# EAGLE design c264-magic-cart-rev1 (EAGLE 9.6.2)
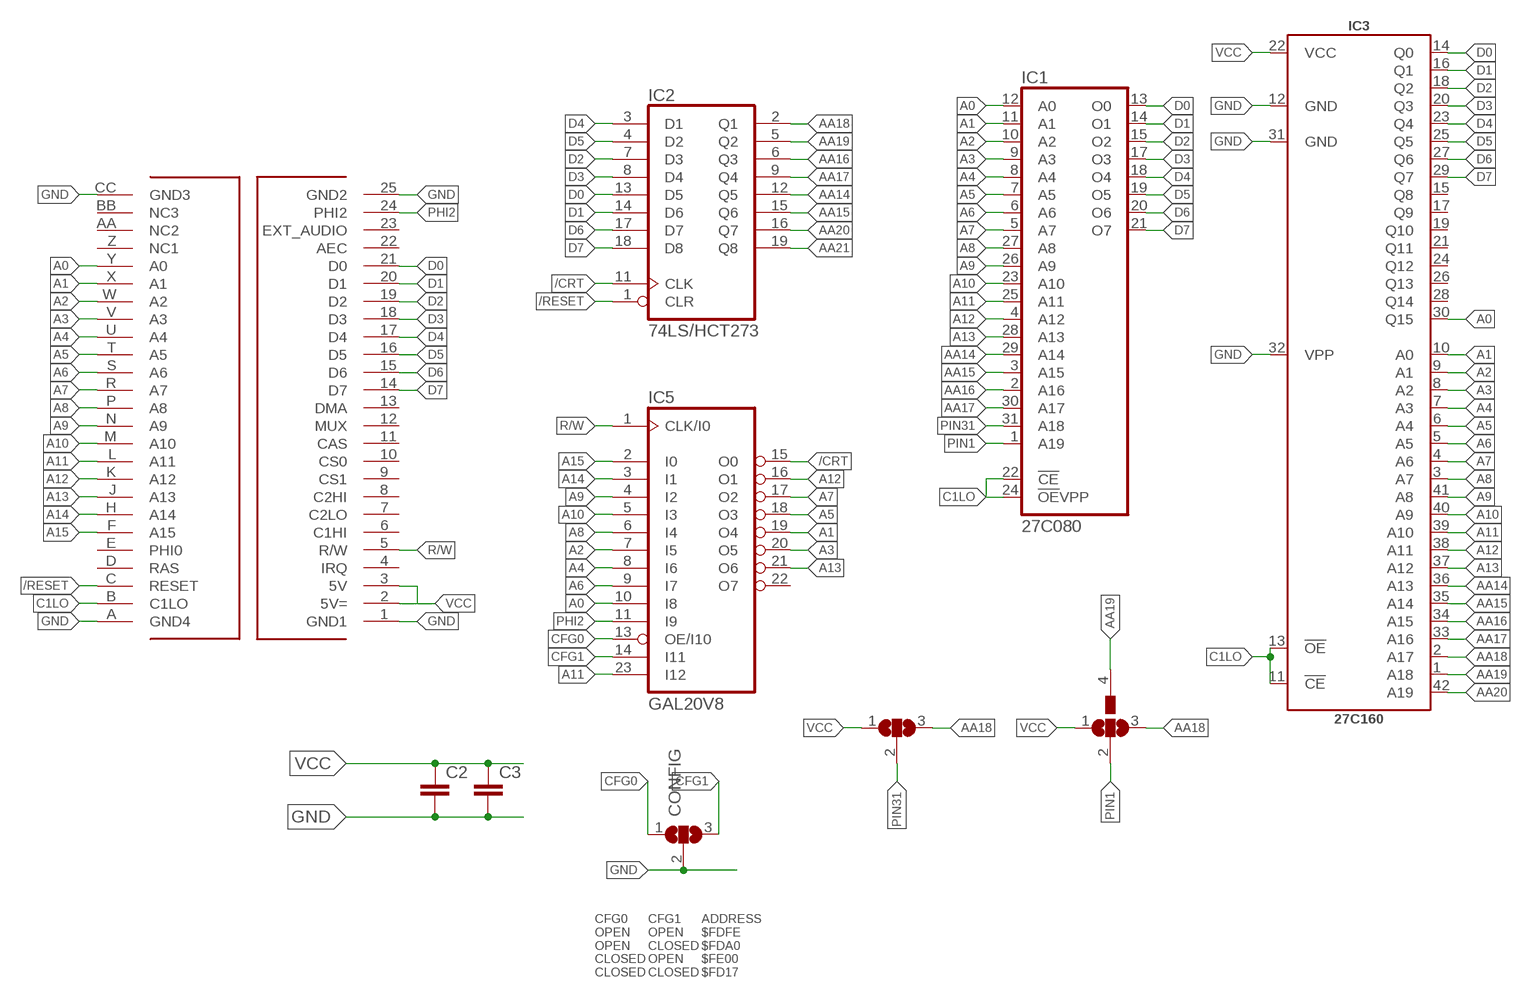
[diagram p0: schematic, sheet 1]

## Parts
C2  C-EU025-024X044  [C025-024X044]
C3  C-EU025-024X044  [C025-024X044]
CONFIG  SJ2W  [SJ_2]
IC1  27C080  27C08032P6  [DIL32]
IC2  74LS/HCT273  74HCT273N  [DIL20]
IC3  27C160  27C160_DIP42  [DIP42]
IC5  GAL20V8  20V8  [DIL24-3]
SJ1  SJ2W  [SJ_2]
U$1  C16_CARTRIDGE  [C16_CART]
U$2  SJ3  [SJ_3]

## Nets
/CRT: IC2.11(CLK) IC5.15(O0)
/RESET: IC2.1(CLR) U$1.C(RESET)
A0: IC1.12(A0) IC3.30(Q15) IC5.10(I8) U$1.Y(A0)
A1: IC1.11(A1) IC3.10(A0) IC5.19(O4) U$1.X(A1)
A2: IC1.10(A2) IC3.9(A1) IC5.7(I5) U$1.W(A2)
A3: IC1.9(A3) IC3.8(A2) IC5.20(O5) U$1.V(A3)
A4: IC1.8(A4) IC3.7(A3) IC5.8(I6) U$1.U(A4)
A5: IC1.7(A5) IC3.6(A4) IC5.18(O3) U$1.T(A5)
A6: IC1.6(A6) IC3.5(A5) IC5.9(I7) U$1.S(A6)
A7: IC1.5(A7) IC3.4(A6) IC5.17(O2) U$1.R(A7)
A8: IC1.27(A8) IC3.3(A7) IC5.6(I4) U$1.P(A8)
A9: IC1.26(A9) IC3.41(A8) IC5.4(I2) U$1.N(A9)
A10: IC1.23(A10) IC3.40(A9) IC5.5(I3) U$1.M(A10)
A11: IC1.25(A11) IC3.39(A10) IC5.23(I12) U$1.L(A11)
A12: IC1.4(A12) IC3.38(A11) IC5.16(O1) U$1.K(A12)
A13: IC1.28(A13) IC3.37(A12) IC5.21(O6) U$1.J(A13)
A14: IC5.3(I1) U$1.H(A14)
A15: IC5.2(I0) U$1.F(A15)
AA14: IC1.29(A14) IC2.12(Q5) IC3.36(A13)
AA15: IC1.3(A15) IC2.15(Q6) IC3.35(A14)
AA16: IC1.2(A16) IC2.6(Q3) IC3.34(A15)
AA17: IC1.30(A17) IC2.9(Q4) IC3.33(A16)
AA18: IC2.2(Q1) IC3.2(A17) SJ1.3 U$2.3
AA19: IC2.5(Q2) IC3.1(A18) U$2.4
AA20: IC2.16(Q7) IC3.42(A19)
AA21: IC2.19(Q8)
C1LO: IC1.22(!CE) IC1.24(!OE!VPP) IC3.11(!CE) IC3.13(!OE) U$1.B(C1LO)
CFG0: CONFIG.1 IC5.13(OE/I10)
CFG1: CONFIG.3 IC5.14(I11)
D0: IC1.13(O0) IC2.13(D5) IC3.14(Q0) U$1.21(D0)
D1: IC1.14(O1) IC2.14(D6) IC3.16(Q1) U$1.20(D1)
D2: IC1.15(O2) IC2.7(D3) IC3.18(Q2) U$1.19(D2)
D3: IC1.17(O3) IC2.8(D4) IC3.20(Q3) U$1.18(D3)
D4: IC1.18(O4) IC2.3(D1) IC3.23(Q4) U$1.17(D4)
D5: IC1.19(O5) IC2.4(D2) IC3.25(Q5) U$1.16(D5)
D6: IC1.20(O6) IC2.17(D7) IC3.27(Q6) U$1.15(D6)
D7: IC1.21(O7) IC2.18(D8) IC3.29(Q7) U$1.14(D7)
GND: C2.2 C3.2 CONFIG.2 IC3.12(GND) IC3.31(GND) IC3.32(VPP) U$1.1(GND1) U$1.25(GND2) U$1.A(GND4) U$1.CC(GND3)
PHI2: IC5.11(I9) U$1.24(PHI2)
PIN1: IC1.1(A19) U$2.2
PIN31: IC1.31(A18) SJ1.2
R/W: IC5.1(CLK/I0) U$1.5(R/W)
VCC: C2.1 C3.1 IC3.22(VCC) SJ1.1 U$1.2(5V=) U$1.3(5V) U$2.1
Unconnected: IC3.15(Q8) IC3.17(Q9) IC3.19(Q10) IC3.21(Q11) IC3.24(Q12) IC3.26(Q13) IC3.28(Q14) IC5.22(O7) U$1.4(IRQ) U$1.6(C1HI) U$1.7(C2LO) U$1.8(C2HI) U$1.9(CS1) U$1.10(CS0) U$1.11(CAS) U$1.12(MUX) U$1.13(DMA) U$1.22(AEC) U$1.23(EXT_AUDIO) U$1.AA(NC2) U$1.BB(NC3) U$1.D(RAS) U$1.E(PHI0) U$1.Z(NC1)

## Notes on the sheet
- CFG0
  OPEN
  OPEN
  CLOSED
  CLOSED
- CFG1
  OPEN
  CLOSED
  OPEN
  CLOSED
- ADDRESS
  $FDFE
  $FDA0
  $FE00
  $FD17

## Power pins joined to a net without a drawn wire
GND: IC1.16(GND) IC2.10(GND) IC5.12(GND)
VCC: IC1.32(VCC) IC2.20(VCC) IC5.24(VCC)

## Library data of the parts
C2 C3 = rcl:C-EU: CAPACITOR, European symbol; SPICEPREFIX: C
CONFIG = jumper:SJ2W: SMD solder JUMPER
IC1 = atmel_mod:27C080: 8-Megabit (1Mx8) OTP EPROM; MPN: AT27C080-90PU; OC_FARNELL: 1455026; OC_NEWARK: 58M3824
IC2 = 74xx-eu:74*273: Octal D type FLIP FLOP, clear
IC3 = sj_ic:27C160: 27C160 16 Mbit (2048 Kbit x 8 or 1024 Kbit x 16) EPROM
IC5 = pal:20V8: PAL; MF: FARNELL; MPN: GAL20V8B-25QP; OC_FARNELL: 3327462; OC_NEWARK: 70C8546
SJ1 = jumper-edit:SJ2W: SMD solder JUMPER
U$1 = 64kb_cart-twoboxes-short:C16_CARTRIDGE
U$2 = jumper-edit:SJ3

## Board
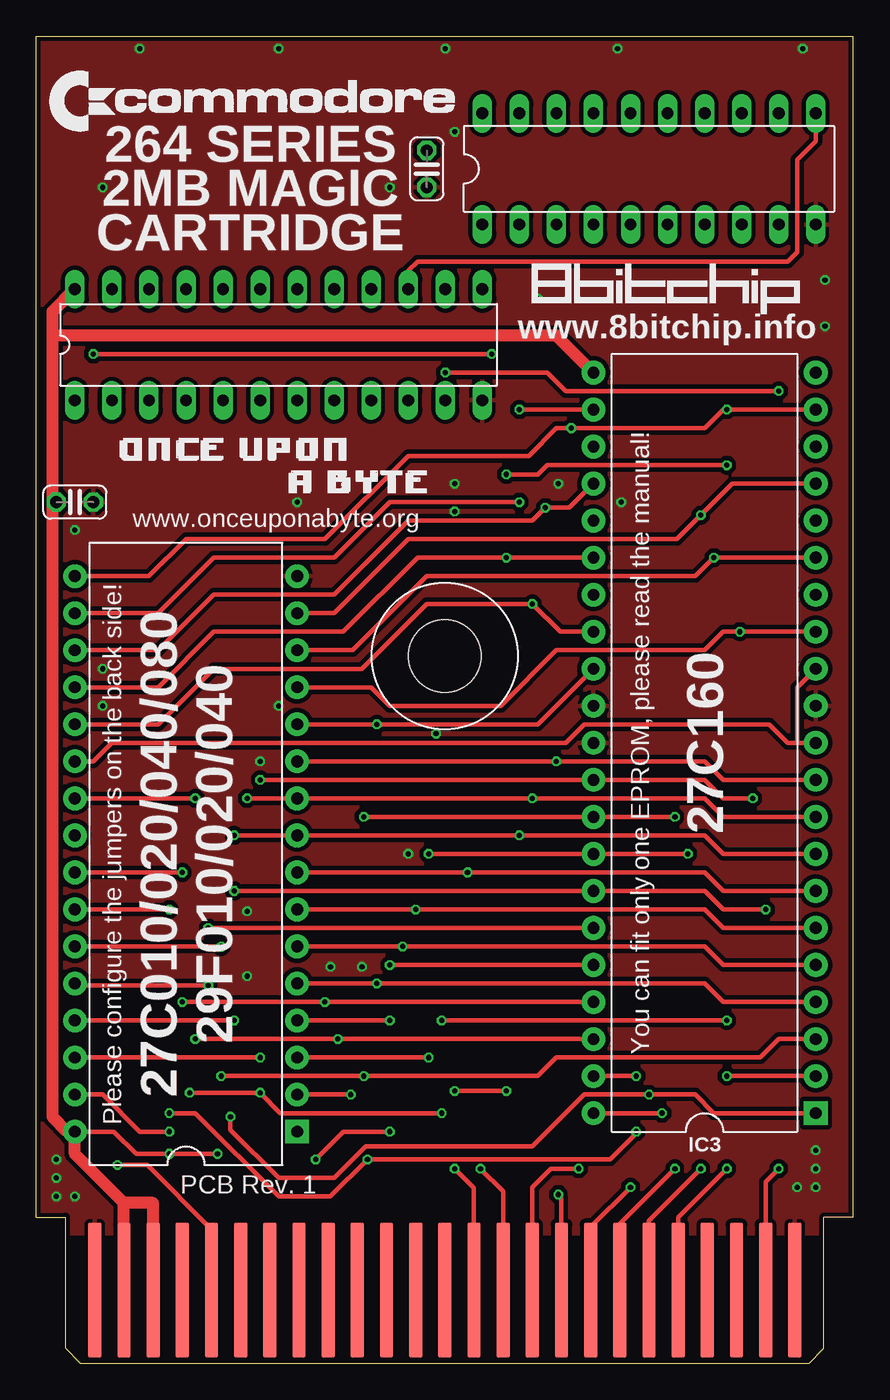
[diagram p1: board, top side]
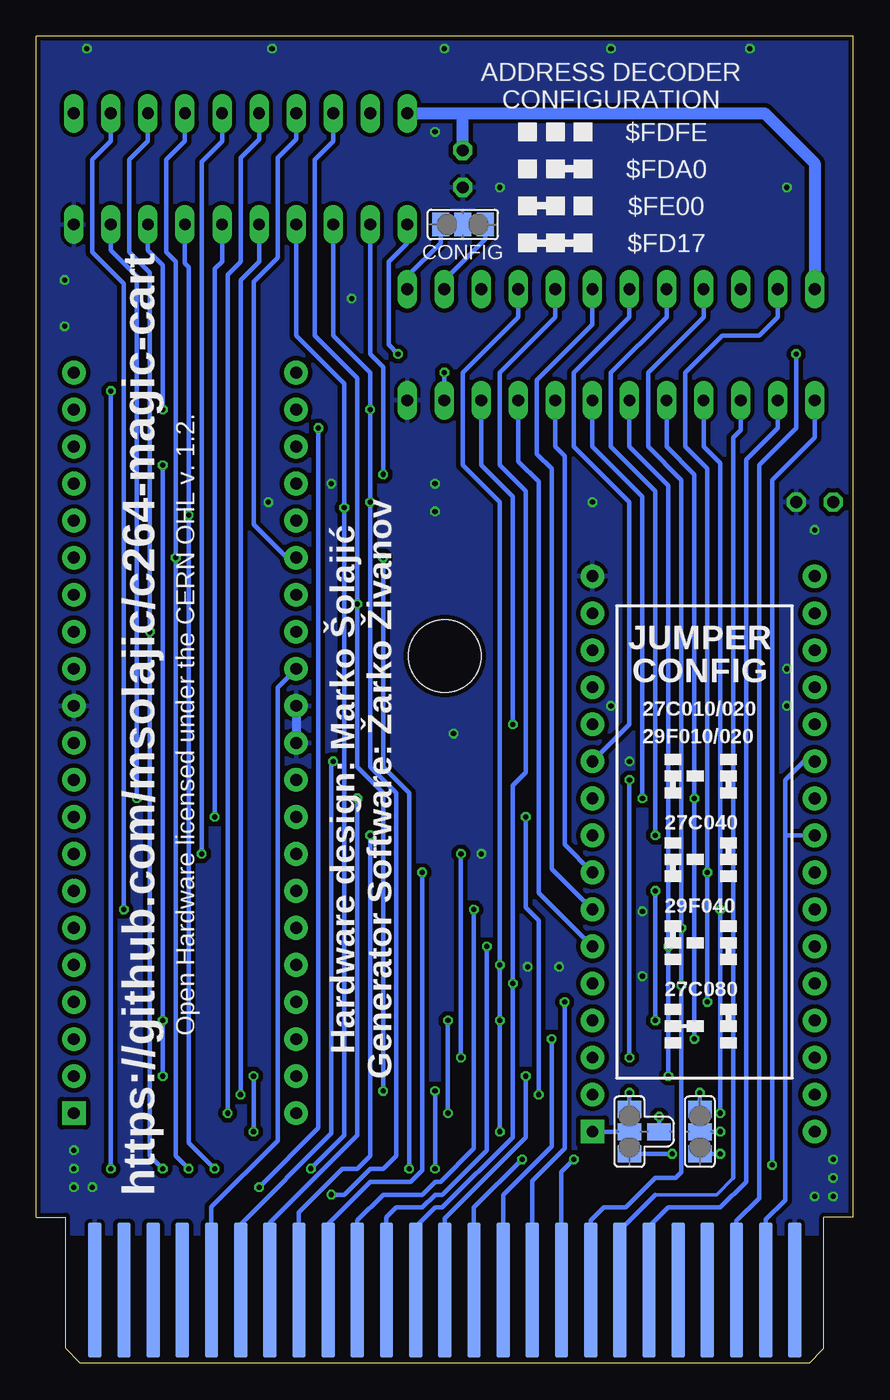
[diagram p2: board, bottom side, seen from below]

Size 56 x 91 mm. Coordinates in mm from the lower left corner, seen from the top.
Copper layers (1*16): Top 0.035mm / dielectric 1.5mm / Bottom 0.035mm
Design rules "SeeedStudio_2layer_DRU_no_angle_20140221": minimum track width 6mil, minimum drill 12mil, track to track 6mil, track to pad 6mil, pad to pad 6mil, via to via 6mil, smd to smd 0mil, copper to edge 10mil, drill to drill 10mil, minimum pad ring 10mil, minimum via ring 6mil, stop-mask expansion 2mil, vias tented up to drill 100mil, thermal gap 10mil

### Footprints (pad centres in the part's own frame; a part is rotated, then mirrored left to right if it is on the bottom)
C025-024X044 = drill 0.813 octagon: 1 -1.27,0; 2 1.27,0
SJ_2 = smd 1.168 x 1.6: 1 -1.524,0; 2 0,0; 3 1.524,0
DIL32 = drill 0.813 pad 1.626 square: 1 -19.05,-7.62 | drill 0.813 pad 1.626: 2 -16.51,-7.62; 3 -13.97,-7.62; 4 -11.43,-7.62; 5 -8.89,-7.62; 6 -6.35,-7.62; 7 -3.81,-7.62; 8 -1.27,-7.62; 9 1.27,-7.62; 10 3.81,-7.62; 11 6.35,-7.62; 12 8.89,-7.62; 13 11.43,-7.62; 14 13.97,-7.62; 15 16.51,-7.62; 16 19.05,-7.62; 17 19.05,7.62; 18 16.51,7.62; 19 13.97,7.62; 20 11.43,7.62; 21 8.89,7.62; 22 6.35,7.62; 23 3.81,7.62; 24 1.27,7.62; 25 -1.27,7.62; 26 -3.81,7.62; 27 -6.35,7.62; 28 -8.89,7.62; 29 -11.43,7.62; 30 -13.97,7.62; 31 -16.51,7.62; 32 -19.05,7.62
DIL20 = drill 0.813 long: 1 -11.43,-3.81; 2 -8.89,-3.81; 3 -6.35,-3.81; 4 -3.81,-3.81; 5 -1.27,-3.81; 6 1.27,-3.81; 7 3.81,-3.81; 8 6.35,-3.81; 9 8.89,-3.81; 10 11.43,-3.81; 11 11.43,3.81; 12 8.89,3.81; 13 6.35,3.81; 14 3.81,3.81; 15 1.27,3.81; 16 -1.27,3.81; 17 -3.81,3.81; 18 -6.35,3.81; 19 -8.89,3.81; 20 -11.43,3.81
DIP42 = drill 0.813 pad 1.626 square: 1 -25.4,-7.62 | drill 0.813 pad 1.626: 2 -22.86,-7.62; 3 -20.32,-7.62; 4 -17.78,-7.62; 5 -15.24,-7.62; 6 -12.7,-7.62; 7 -10.16,-7.62; 8 -7.62,-7.62; 9 -5.08,-7.62; 10 -2.54,-7.62; 11 0,-7.62; 12 2.54,-7.62; 13 5.08,-7.62; 14 7.62,-7.62; 15 10.16,-7.62; 16 12.7,-7.62; 17 15.24,-7.62; 18 17.78,-7.62; 19 20.32,-7.62; 20 22.86,-7.62; 21 25.4,-7.62; 22 25.4,7.62; 23 22.86,7.62; 24 20.32,7.62; 25 17.78,7.62; 26 15.24,7.62; 27 12.7,7.62; 28 10.16,7.62; 29 7.62,7.62; 30 5.08,7.62; 31 2.54,7.62; 32 0,7.62; 33 -2.54,7.62; 34 -5.08,7.62; 35 -7.62,7.62; 36 -10.16,7.62; 37 -12.7,7.62; 38 -15.24,7.62; 39 -17.78,7.62; 40 -20.32,7.62; 41 -22.86,7.62; 42 -25.4,7.62
DIL24-3 = drill 0.813 long: 1 -13.97,-3.81; 2 -11.43,-3.81; 3 -8.89,-3.81; 4 -6.35,-3.81; 5 -3.81,-3.81; 6 -1.27,-3.81; 7 1.27,-3.81; 8 3.81,-3.81; 9 6.35,-3.81; 10 8.89,-3.81; 11 11.43,-3.81; 12 13.97,-3.81; 13 13.97,3.81; 14 11.43,3.81; 15 8.89,3.81; 16 6.35,3.81; 17 3.81,3.81; 18 1.27,3.81; 19 -1.27,3.81; 20 -3.81,3.81; 21 -6.35,3.81; 22 -8.89,3.81; 23 -11.43,3.81; 24 -13.97,3.81
C16_CART = smd 0.9 x 9.25: 1 2,5; 2 4,5; 3 6,5; 4 8,5; 5 10,5; 6 12,5; 7 14,5; 8 16,5; 9 18,5; 10 20,5; 11 22,5; 12 24,5; 13 26,5; 14 28,5; 15 30,5; 16 32,5; 17 34,5; 18 36,5; 19 38,5; 20 40,5; 21 42,5; 22 44,5; 23 46,5; 24 48,5; 25 50,5 | smd 0.9 x 9.25 bottom: A 2,5; AA 46,5; B 4,5; BB 48,5; C 6,5; CC 50,5; D 8,5; E 10,5; F 12,5; H 14,5; J 16,5; K 18,5; L 20,5; M 22,5; N 24,5; P 26,5; R 28,5; S 30,5; T 32,5; U 34,5; V 36,5; W 38,5; X 40,5; Y 42,5; Z 44,5 | hole 5: 26,48.5
SJ_3 = smd 1.168 x 1.6: 1 -1.524,0; 2 0,0; 3 1.524,0; 4 0,-2.032

### Placement (x,y rotation side)
C2  26.77,81.92 270 top
C3  2.63,59.05 0 top
CONFIG  26.77,78.11 0 bottom
IC1  10.26,34.92 90 top
IC2  42.01,81.92 0 top
IC3  45.81,42.55 90 top
IC5  16.61,69.85 0 top
SJ1  10.51,15.88 90 bottom
U$1  2,0 0 top
U$2  15.34,15.88 90 bottom

### Tracks (layer width: path | path; a pad name or v marks a point on that pad's centre or on a via)
/CRT
  Top 0.305: IC5.15 25.5,74.93 26.13,75.56 51.53,75.56 52.16,76.2 52.16,82.55 53.44,83.82 IC2.11
/RESET  (via drill 0.35)
  Top 0.305: v31.21,69.22 v3.91,69.22
  Bottom 0.305: U$1.C 8,9.75 6.45,11.3 6.45,61.59 3.91,64.14 v3.91,69.22 | IC2.1 30.57,76.83 31.84,75.56 31.84,69.85 v31.21,69.22
A0  (via drill 0.35)
  Top 0.305: IC1.12 v23.34,43.81 34.38,43.81 IC3.30
  Bottom 0.305: U$1.Y 44,10.71 39.47,15.24 39.47,46.35 IC3.30 | IC5.10 25.5,61.59 23.34,59.44 v23.34,43.81
A1  (via drill 0.35)
  Top 0.305: IC3.10 47.09,40.01 45.81,41.27 v35.66,41.27 IC1.11
  Bottom 0.305: U$1.X 42,9.53 35.78,15.75 35.78,41.15 v35.66,41.27 | IC1.11 15.34,43.81 15.34,59.05 19.14,62.87 19.14,67.94 15.34,71.75 IC5.19
A2  (via drill 0.35)
  Top 0.305: IC3.9 47.09,37.47 45.81,38.73 v34,38.73 IC1.10 v14.45,38.73
  Bottom 0.305: U$1.W 40,9.62 34,15.62 v34,38.73 | v14.45,38.73 14.45,59.44 17.88,62.87 IC5.7
A3  (via drill 0.35)
  Top 0.305: IC3.8 47.09,34.92 45.81,36.2 v33.11,36.2 IC1.9 v13.56,36.2
  Bottom 0.305: v13.56,36.2 13.56,59.82 16.61,62.87 16.61,67.94 12.79,71.75 IC5.20 | U$1.V 38,10.36 35.02,13.34 34,13.34 33.11,14.22 v33.11,36.2
A4  (via drill 0.35)
  Top 0.305: IC1.8 v29.56,33.66 45.81,33.66 47.09,32.38 IC3.7
  Bottom 0.305: IC5.8 20.41,62.87 19.78,62.23 19.78,35.56 IC1.8 | U$1.U 36,9.56 33.11,12.45 30.32,12.45 29.56,13.21 v29.56,33.66
A5  (via drill 0.35)
  Top 0.305: IC1.7 v26,31.11 45.81,31.11 47.09,29.84 IC3.6
  Bottom 0.305: IC5.18 17.88,71.25 21.68,67.44 21.68,62.36 20.67,61.34 20.67,33.91 IC1.7 | U$1.T 34,9.78 32.23,11.56 29.56,11.56 28.67,12.45 28.29,12.45 26,14.73 v26,31.11
A6  (via drill 0.35)
  Top 0.305: IC1.6 v25.11,28.57 45.81,28.57 47.09,27.3 IC3.5
  Bottom 0.305: IC5.9 22.95,61.85 21.56,60.45 21.56,32.26 IC1.6 | v25.11,28.57 25.11,14.61 28.16,11.56 28.67,11.56 29.56,10.67 31.34,10.67 32,10.01 U$1.S
A7  (via drill 0.35)
  Top 0.305: IC1.5 v23.34,26.04 45.81,26.04 47.09,24.77 IC3.4
  Bottom 0.305: IC5.17 20.41,71.75 24.23,67.94 24.23,61.59 22.45,59.82 22.45,40.51 23.34,39.62 v23.34,26.04 23.34,15.49 28.16,10.67 28.67,10.67 30,9.34 U$1.R
A8  (via drill 0.35)
  Top 0.305: IC1.27 v12.67,28.57 | IC3.3 50.9,22.23 49.62,20.95 35.66,20.95 34.38,19.68 v22.45,19.68 v12.67,19.68
  Bottom 0.305: v12.67,19.68 v12.67,28.57 12.67,60.2 15.34,62.87 IC5.6 | U$1.P 28,9.94 22.45,15.49 v22.45,19.68
A9  (via drill 0.35)
  Top 0.305: v9.11,31.11 IC1.26 | v9.11,17.14 10.89,17.14 16.61,11.43 20.16,11.43 v22.7,13.97 39.34,13.97 41.12,15.75 v41.12,15.88 | v41.12,19.68 IC3.41
  Bottom 0.305: v9.11,17.14 v9.11,31.11 9.11,61.72 10.26,62.87 IC5.4 | U$1.N 26,10.67 v22.7,13.97 | v41.12,15.88 v41.12,19.68
A10  (via drill 0.35)
  Top 0.305: IC3.40 v20.67,22.23 v10.89,22.23 | v10.89,38.73 IC1.23
  Bottom 0.305: v10.89,22.23 v10.89,38.73 10.89,60.96 12.79,62.87 IC5.5 | U$1.M 24,11.53 20.67,14.86 v20.67,22.23
A11  (via drill 0.35)
  Top 0.305: IC3.39 v19.78,24.77 v10,24.77 | v10,33.66 IC1.25
  Bottom 0.305: v10,24.77 v10,33.66 10,61.34 11.53,62.87 11.53,67.94 8.98,70.48 6.45,70.48 5.17,71.75 IC5.23 | v19.78,24.77 19.78,14.73 22,12.51 U$1.L
A12  (via drill 0.35)
  Top 0.305: IC1.4 v24.23,23.5 | IC3.38 v24.23,27.3 | v19.14,13.97 21.05,15.88 v24.23,15.88
  Bottom 0.305: IC5.16 22.95,71.75 26.77,67.94 26.77,61.59 24.23,59.05 v24.23,27.3 v24.23,23.5 v24.23,15.88 | U$1.K 20,13.12 v19.14,13.97
A13  (via drill 0.35)
  Top 0.305: IC3.37 v11.78,29.84 | v11.78,25.91 2.76,25.91 IC1.28
  Bottom 0.305: IC5.21 10.26,71.75 14.06,67.94 14.06,62.87 11.78,60.58 v11.78,29.84 v11.78,25.91 11.78,13.08 12.16,12.7 13.56,12.7 15.59,10.67 17.11,10.67 18,9.78 U$1.J
A14
  Bottom 0.254: 13.56,11.56 9.37,11.56 8.22,12.7
  Bottom 0.305: 8.22,12.7 8.22,63.5 7.71,64.01 IC5.3 | U$1.H 16,9.11 13.56,11.56
A15
  Bottom 0.305: U$1.F 14,9.34 12.67,10.67 9.11,10.67 7.33,12.45 7.33,16 7.33,61.98 5.17,64.14 IC5.2
AA14  (via drill 0.35)
  Top 0.305: v13.56,32.38 IC3.36 45.81,32.38 47.09,31.11 v50.01,31.11 | v13.56,23.5 IC1.29
  Bottom 0.305: v13.56,32.38 v13.56,23.5 | IC2.12 50.9,83.82 52.16,82.55 52.16,76.2 50.01,74.04 v50.01,31.11
AA15  (via drill 0.35)
  Top 0.305: v26.89,34.92 IC3.35 v44.67,34.92 | v26.89,20.95 IC1.3
  Bottom 0.305: v26.89,34.92 v26.89,20.95 | IC2.15 43.27,83.82 44.67,82.42 v44.67,34.92
AA16  (via drill 0.35)
  Top 0.305: v22.45,37.47 IC3.34 v43.78,37.47 | v21.56,18.41 IC1.2
  Bottom 0.305: v43.78,37.47 43.78,73.03 43.78,73.15 43.78,75.06 43.27,75.56 IC2.6 | v22.45,37.47 22.45,31.24 21.56,30.35 v21.56,18.41
AA17  (via drill 0.35)
  Top 0.305: v15.34,40.01 IC3.33 45.81,40.01 47.09,38.73 v49.12,38.73 | IC1.30 v15.34,20.95
  Bottom 0.305: IC2.9 50.9,76.33 49.12,74.55 v49.12,38.73 | v15.34,40.01 v15.34,20.95
AA18  (via drill 0.35)
  Top 0.305: v47.34,61.59 35.02,61.59 34.38,60.96 v32.23,60.96 | IC3.2 v47.34,19.68 | v27.78,23.5 v47.34,23.5 | v10.51,18.54 v15.34,18.54 16.73,17.14 v27.78,17.14
  Bottom 0.305: v47.34,61.59 v47.34,23.5 v47.34,19.68 | v32.23,60.96 32.23,68.33 33.11,69.22 IC2.2 | v27.78,17.14 v27.78,23.5 | SJ1.3 v10.51,18.54 | v15.34,18.54 U$2.3
AA19  (via drill 0.35)
  Top 0.305: IC3.1 46.45,17.14 45.18,18.41 v42.01,18.41 37.56,18.41 34,14.86 22.57,14.86 20.41,12.7 16.61,12.7 13.3,16 v13.3,16.89
  Bottom 0.305: IC2.5 40.73,75.56 42.01,74.3 v42.01,18.41 | v13.3,16.89 U$2.4
AA20  (via drill 0.35)
  Top 0.305: v42.89,17.14 IC3.42
  Bottom 0.305: IC2.16 40.73,83.95 42.01,82.68 42.01,75.56 42.89,74.68 v42.89,17.14
C1LO
  Top 0.305: 52.16,42.55 51.53,42.55 50.26,43.81 37.56,43.81 36.29,42.55 5.17,42.55 3.91,41.27 IC1.22 | 52.16,42.55 IC3.11 | IC3.13 52.16,46.35 52.16,42.55
  Bottom 0.305: U$1.B 6,9.84 4.67,11.18 4.67,36.2 | 4.67,36.2 4.67,40.01 3.4,41.27 IC1.22 | IC1.24 4.67,36.2
CFG0
  Bottom 0.305: CONFIG.1 28.29,76.83 30.57,74.55 IC5.13
CFG1
  Bottom 0.305: CONFIG.3 25.24,77.09 28.04,74.3 IC5.14
D0  (via drill 0.35)
  Top 0.305: IC1.13 22.95,46.35 24.23,45.09 31.84,45.09 35.66,48.9 45.81,48.9 47.09,50.16 v48.23,50.16 IC3.14 | U$1.21 44,10 v47.34,13.34
  Bottom 0.305: v47.34,13.34 48.23,14.22 v48.23,50.16 48.23,73.03 48.23,73.15 48.23,74.8 49.62,76.2 49.62,82.55 48.35,83.82 IC2.13
D1  (via drill 0.35)
  Top 0.305: IC1.14 21.68,48.9 26.77,53.98 45.18,53.98 v46.45,55.24 IC3.16 | U$1.20 42,9.77 v45.56,13.34
  Bottom 0.305: v45.56,13.34 46.45,14.22 v46.45,55.24 46.45,75.56 47.09,76.2 47.09,82.55 45.81,83.82 IC2.14
D2  (via drill 0.35)
  Top 0.305: IC3.18 47.72,60.33 v45.56,58.17 43.91,56.52 25.5,56.52 20.41,51.44 IC1.15 | U$1.19 40,9.55 v43.78,13.34
  Bottom 0.305: IC2.7 45.81,75.44 45.56,75.18 v45.56,58.17 45.56,15.11 v43.78,13.34
D3  (via drill 0.35)
  Top 0.305: IC3.20 v47.34,65.41 47.09,65.41 45.81,64.14 v36.67,64.14 35.66,64.14 33.75,62.23 25.5,62.23 19.78,56.52 10.26,56.52 7.71,53.98 IC1.17 | U$1.18 38,9.33 v40.73,12.06
  Bottom 0.305: IC2.8 48.35,76.33 47.34,75.31 v47.34,65.41 | v40.73,12.06 36.67,16.13 v36.67,64.14
D4  (via drill 0.35)
  Top 0.305: IC1.18 8.35,51.44 12.16,55.24 20.41,55.24 24.23,59.05 v33.11,59.05 | IC3.23 v33.11,65.41 | U$1.17 36,11.34 v35.78,11.56
  Bottom 0.305: IC2.3 35.66,70.48 33.11,67.94 v33.11,65.41 v33.11,59.05 33.11,40.89 31.34,39.12 31.34,14.22 32.23,13.34 33.11,13.34 34.89,11.56 v35.78,11.56
D5  (via drill 0.35)
  Top 0.305: IC1.19 8.35,48.9 12.16,52.7 20.41,52.7 25.5,57.78 34,57.78 v34.89,58.67 36.54,58.67 IC3.25 | U$1.16 34,12.06 35.27,13.34 v37.18,13.34
  Bottom 0.305: IC2.4 38.2,70.48 34.89,67.18 v34.89,58.67 34.89,15.63 v37.18,13.34
D6  (via drill 0.35)
  Top 0.305: IC3.27 v32.23,55.24 26.13,55.24 21.05,50.16 12.16,50.16 8.35,46.35 IC1.20 | U$1.15 32,11.78 v30.45,13.34
  Bottom 0.305: IC3.27 38.83,55.24 41.12,57.53 41.12,74.17 39.47,75.82 39.47,82.68 38.2,83.95 IC2.17 | v30.45,13.34 30.45,39.12 32.23,40.89 v32.23,55.24
D7  (via drill 0.35)
  Top 0.305: IC1.21 8.35,43.81 12.16,47.62 22.32,47.62 26.77,52.07 v34,52.07 35.91,50.16 IC3.29 | U$1.14 30,12.01 v28.67,13.34 | v28.67,18.67 v32.23,18.67
  Bottom 0.305: v28.67,18.67 v28.67,13.34 | v32.23,18.67 32.23,39.12 34,40.89 v34,52.07 34,67.56 36.92,70.48 36.92,82.55 35.66,83.82 IC2.18
GND  (via drill 0.35)
  Bottom 0.61: IC3.31 IC3.32
  other vias: 17.88,59.05 2.63,11.43 27.4,43.18 15.34,41.27 25.5,34.92 14.45,30.99 14.45,26.54 20.16,27.18 22.32,27.18 28.67,60.33 28.67,58.42 35.78,60.33 4.54,80.64 24.23,80.64 28.67,84.45 28.04,90.17 16.61,90.17 7.08,90.17 53.44,13.34 2.63,57.15 40.1,59.05 4.54,47.62 4.54,45.09 16.61,45.09 34.38,73.03 54.07,74.3 54.07,71.12 39.85,90.17 52.55,90.17 1.36,11.43 1.36,12.7 1.36,13.97 53.44,12.06 53.44,14.61 52.16,12.06
  pour Bottom (isolate 0.305): -2.7,94.61 59.15,94.61 59.15,8.89 -2.7,8.89
  pour Top (isolate 0.305): -7.02,94.61 57.88,94.61 57.88,8.89 -7.02,8.89
PHI2  (via drill 0.35)
  Top 0.305: U$1.24 50,12.44 v50.9,13.34 | v28.04,67.94 35.02,67.94 36.29,66.67 v50.9,66.67
  Bottom 0.305: v50.9,13.34 v50.9,66.67 | IC5.11 v28.04,67.94
PIN1
  Bottom 0.305: U$2.2 IC1.1
PIN31  (via drill 0.35)
  Top 0.305: IC1.31 4.54,18.41 7.08,15.88 v9.11,15.88
  Bottom 0.305: v9.11,15.88 SJ1.2
R/W  (via drill 0.35)
  Top 0.305: U$1.5 12,9.18 7.59,13.59 v5.56,13.59
  Bottom 0.305: v5.56,13.59 5.56,60.58 2.63,63.5 IC5.1
VCC  (via drill 0.35)
  Top 0.305: IC1.32 5.3,15.88 6.83,14.35 v9.11,14.35 v12.41,14.35
  Top 0.406: C3.1 1.11,59.05
  Top 0.813: U$1.2 6,10.99 | 6,10.99 2.63,14.35 IC1.32 2.13,15.88 1.11,16.89 1.11,59.05 1.11,70.48 | IC5.24 1.11,72.14 1.11,70.48 | U$1.3 8,10.99 6,10.99 | IC3.22 35.66,70.48 1.11,70.48
  Bottom 0.305: v9.11,14.35 SJ1.1 | v12.41,14.35 U$2.1
  Bottom 0.813: IC2.20 26.77,85.72 | 26.77,85.72 6.06,85.72 2.63,82.3 IC5.24 | C2.1 26.77,85.72

### Text on the board
tNames: 264 SERIES / 2MB MAGIC / CARTRIDGE | www.8bitchip.info | www.onceuponabyte.org | You can fit only one EPROM, please read the manual! | Please configure the jumpers on the back side! | 27C010/020/040/080 / 29F010/020/040 | PCB Rev. 1
bNames: ADDRESS DECODER / CONFIGURATION | $FDFE / $FDA0 / $FE00 / $FD17 | JUMPER / CONFIG | 27C010/020 / 29F010/020 | Open Hardware licensed under the CERN OHL v. 1.2. | https://github.com/msolajic/c264-magic-cart | Hardware design: Marko Šolajić / Generator Software: Žarko Živanov | 27C040 | 29F040 | 27C080